# EAGLE schematic usbSimStepper-v10 (EAGLE 5.04)
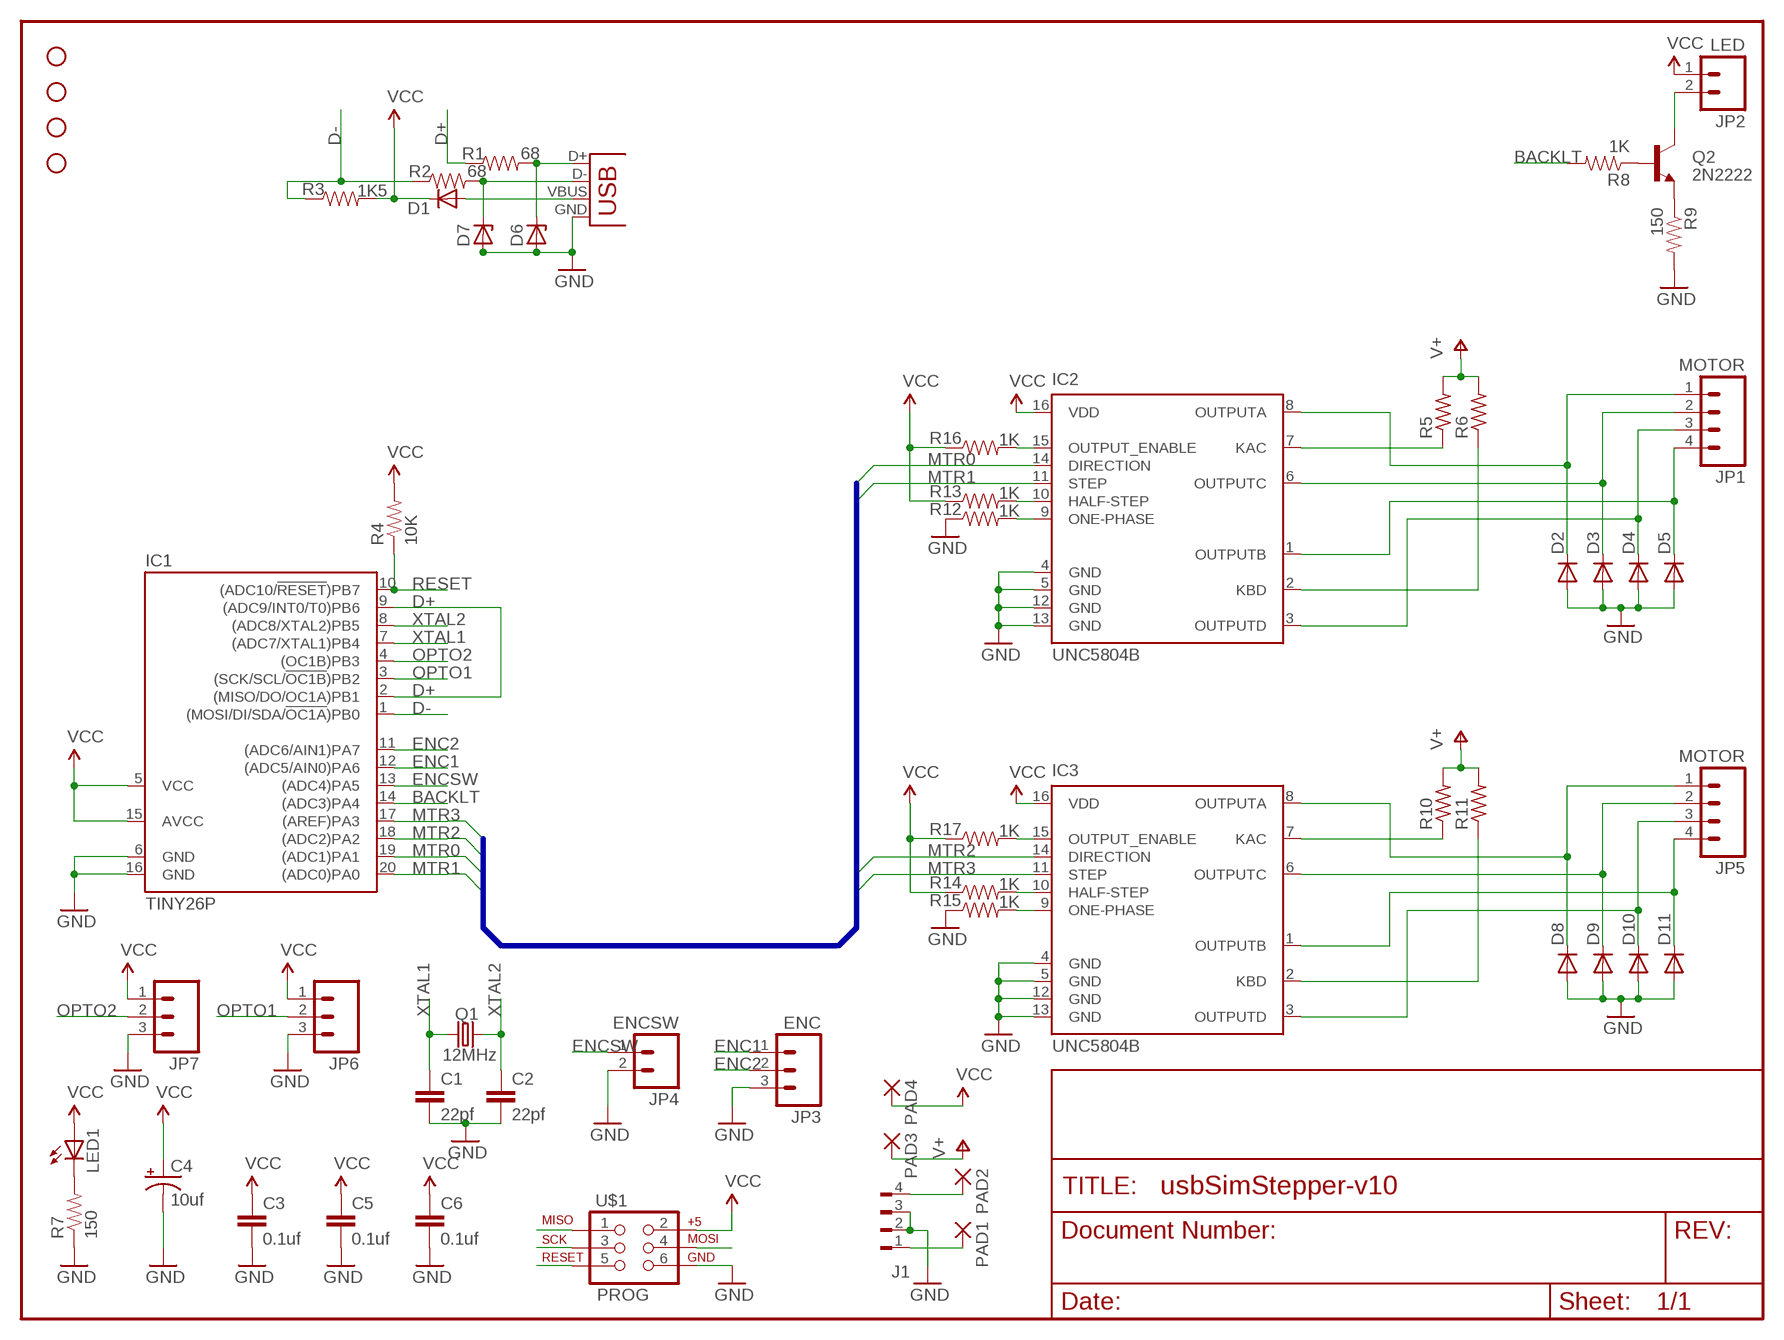
[diagram p0: schematic, sheet 1]

## Parts
C1  22pf  CAPPTH2  [CAP-PTH-SMALL2]
C2  22pf  CAPPTH2  [CAP-PTH-SMALL2]
C3  0.1uf  CAPPTH2  [CAP-PTH-SMALL2]
C4  10uf  CAP_POLPTH2  [CPOL-RADIAL-10UF-25V]
C5  0.1uf  CAPPTH2  [CAP-PTH-SMALL2]
C6  0.1uf  CAPPTH2  [CAP-PTH-SMALL2]
D1  DIODEPTH2  [DOIDE-1N4148]
D2  DIODEPTH2  [DOIDE-1N4148]
D3  DIODEPTH2  [DOIDE-1N4148]
D4  DIODEPTH2  [DOIDE-1N4148]
D5  DIODEPTH2  [DOIDE-1N4148]
D6  1N4728  [DO41Z10]
D7  1N4728  [DO41Z10]
D8  DIODEPTH2  [DOIDE-1N4148]
D9  DIODEPTH2  [DOIDE-1N4148]
D10  DIODEPTH2  [DOIDE-1N4148]
D11  DIODEPTH2  [DOIDE-1N4148]
IC1  TINY26P  [DIL20]
IC2  UNC5804B  [DIL16]
IC3  UNC5804B  [DIL16]
J1  FLOP-4W  [FLOP-4V]
JP1  MOTOR  M04POLAR  [MOLEX-1X4]
JP2  LED  M02POLAR  [MOLEX-1X2]
JP3  ENC  M03POLAR  [MOLEX-1X3]
JP4  ENCSW  M02PTH  [1X02]
JP5  MOTOR  M04POLAR  [MOLEX-1X4]
JP6  M03POLAR  [MOLEX-1X3]
JP7  M03POLAR  [MOLEX-1X3]
LED1  LED3MM  [LED3MM]
PAD1  2,54/1,1  [2,54/1,1]
PAD2  2,54/1,1  [2,54/1,1]
PAD3  2,54/1,1  [2,54/1,1]
PAD4  2,54/1,1  [2,54/1,1]
Q1  12MHz  CRYSTALHC49US  [HC49US]
Q2  2N2222  TRANSISTOR_NPNTO92  [TO-92]
R1  68  RESISTORPTH1  [AXIAL-0.3]
R2  68  RESISTORPTH1  [AXIAL-0.3]
R3  1K5  RESISTORPTH1  [AXIAL-0.3]
R4  10K  RESISTORPTH1  [AXIAL-0.3]
R5  R-US_0414/5V  [0414V]
R6  R-US_0414/5V  [0414V]
R7  150  RESISTORPTH1  [AXIAL-0.3]
R8  1K  RESISTORPTH1  [AXIAL-0.3]
R9  150  RESISTORPTH1  [AXIAL-0.3]
R10  R-US_0414/5V  [0414V]
R11  R-US_0414/5V  [0414V]
R12  1K  RESISTORPTH1  [AXIAL-0.3]
R13  1K  RESISTORPTH1  [AXIAL-0.3]
R14  1K  RESISTORPTH1  [AXIAL-0.3]
R15  1K  RESISTORPTH1  [AXIAL-0.3]
R16  1K  RESISTORPTH1  [AXIAL-0.3]
R17  1K  RESISTORPTH1  [AXIAL-0.3]
U$1  PROG  AVR_SPI_PRG_6PTH  [2X3]
U$2  STAND-OFF  [STAND-OFF]
U$3  STAND-OFF  [STAND-OFF]
U$4  STAND-OFF  [STAND-OFF]
U$5  STAND-OFF  [STAND-OFF]
X1  USBPTH  [USB-B-PTH]

## Nets
BACKLT: IC1.14((ADC3)PA4) R8.P$2
D+: IC1.2((MISO/DO/OC1A)PB1) IC1.9((ADC9/INT0/T0)PB6) R1.P$1
D-: IC1.1((MOSI/DI/SDA/!OC1A!)PB0) R2.P$1 R3.P$1
ENC1: IC1.12((ADC5/AIN0)PA6) JP3.1
ENC2: IC1.11((ADC6/AIN1)PA7) JP3.2
ENCSW: IC1.13((ADC4)PA5) JP4.1
GND: C1.2 C2.2 C3.2 C4.2(-) C5.2 C6.2 D2.A D3.A D4.A D5.A D6.A D7.A D8.A D9.A D10.A D11.A IC1.6(GND) IC1.16(GND) IC2.4(GND) IC2.5(GND) IC2.12(GND) IC2.13(GND) IC3.4(GND) IC3.5(GND) IC3.12(GND) IC3.13(GND) J1.2 J1.3 JP3.3 JP4.2 JP6.3 JP7.3 R7.P$1 R9.P$2 R12.P$1 R15.P$1 U$1.6 X1.GND
MTR0: IC1.19((ADC1)PA1) IC2.14(DIRECTION)
MTR1: IC1.20((ADC0)PA0) IC2.11(STEP)
MTR2: IC1.18((ADC2)PA2) IC3.14(DIRECTION)
MTR3: IC1.17((AREF)PA3) IC3.11(STEP)
N$1: IC2.9(ONE-PHASE) R12.P$2
N$2: IC2.10(HALF-STEP) R13.P$2
N$3: D7.C R2.P$2 X1.D-
N$4: D6.C R1.P$2 X1.D+
N$5: D1.A X1.VBUS
N$6: J1.4 PAD2.1(P)
N$7: IC3.10(HALF-STEP) R14.P$2
N$8: J1.1 PAD1.1(P)
N$9: IC2.2(KBD) R6.1
N$10: IC2.15(OUTPUT_ENABLE) R16.P$2
N$11: IC3.15(OUTPUT_ENABLE) R17.P$2
N$12: IC2.7(KAC) R5.1
N$13: LED1.K(C) R7.P$2
N$14: Q2.2(B) R8.P$1
N$15: D2.C IC2.8(OUTPUTA) JP1.1
N$16: D3.C IC2.6(OUTPUTC) JP1.2
N$17: D5.C IC2.1(OUTPUTB) JP1.4
N$18: D4.C IC2.3(OUTPUTD) JP1.3
N$19: JP2.2 Q2.3(C)
N$20: Q2.1(E) R9.P$1
N$21: IC3.9(ONE-PHASE) R15.P$2
N$25: IC3.2(KBD) R11.1
N$27: IC3.7(KAC) R10.1
N$28: D8.C IC3.8(OUTPUTA) JP5.1
N$29: D9.C IC3.6(OUTPUTC) JP5.2
N$30: D11.C IC3.1(OUTPUTB) JP5.4
N$31: D10.C IC3.3(OUTPUTD) JP5.3
OPTO1: IC1.3((SCK/SCL/!OC1B!)PB2) JP6.2
OPTO2: IC1.4((OC1B)PB3) JP7.2
PB1: U$1.1 U$1.4
PB2: U$1.3
RESET: IC1.10((ADC10/!RESET!)PB7) R4.P$1 U$1.5
V+: PAD3.1(P) R5.2 R6.2 R10.2 R11.2
VCC: C3.1 C4.1(+) C5.1 C6.1 D1.C IC1.5(VCC) IC1.15(AVCC) IC2.16(VDD) IC3.16(VDD) JP2.1 JP6.1 JP7.1 LED1.A PAD4.1(P) R3.P$2 R4.P$2 R13.P$1 R14.P$1 R16.P$1 R17.P$1 U$1.2
XTAL1: C1.1 IC1.7((ADC7/XTAL1)PB4) Q1.1
XTAL2: C2.1 IC1.8((ADC8/XTAL2)PB5) Q1.2

## Buses
MTR[0..7]

## Library data of the parts
C1-C3 C5 C6 = SparkFun:CAP: Capacitor Standard 0603 ceramic capacitor, and 0.1" leaded capacitor.
C4 = SparkFun:CAP_POL: Capacitor Polarized These are standard SMD and PTH capacitors. Normally 10uF, 47uF, and 100uF in electrolytic and tantalum varieties. Always verify the external diameter of the through hole cap, it varies with capacity, voltage, and manufacturer. The EIA devices should be standard.
D1-D5 D8-D11 = SparkFun:DIODE: Diode These are standard reverse protection diodes and small signal diodes. SMA package can handle up to about 1A. SOD-323 can handle about 200mA. What the SOD-323 package when ordering, there are some mfgs out there that are 5-pin packages.
D6 D7 = diode:1N4728: Z DIODE 3.3 V, 1W, 5 percent
IC1 = atmel:TINY26*: 8-bit AVR Microcontroller with 2K Bytes Flash Source: http://www.atmel.com .. doc1477.pdf
IC2 IC3 = allegro:UNC5804: BiMOS II UNIPOLAR STEPPER-MOTOR TRANSLATOR/DRIVER Source: 5804.pdf
J1 = con-amp:FLOP-4W: MATE N-LOCK Floppy / HDD conector Distributor: Bürklin 71F972
JP1 JP5 = SparkFun:M04: Header 4 Standard 4-pin 0.1" header. Use with straight break away headers (SKU : PRT-00116), right angle break away headers (PRT-00553), swiss pins (PRT-00743), machine pins (PRT-00117), and female headers (PRT-00115). Molex polarized connector foot print use with SKU : PRT-08231 with associated crimp pins and housings.
JP2 JP4 = SparkFun:M02: Header 2 Standard 2-pin 0.1" header. Use with straight break away headers (SKU : PRT-00116), right angle break away headers (PRT-00553), swiss pins (PRT-00743), machine pins (PRT-00117), and female headers (PRT-00115). Molex polarized connector foot print use with SKU : PRT-08233 with associated crimp pins and housings.
JP3 JP6 JP7 = SparkFun:M03: Header 3 Standard 3-pin 0.1" header. Use with straight break away headers (SKU : PRT-00116), right angle break away headers (PRT-00553), swiss pins (PRT-00743), machine pins (PRT-00117), and female headers (PRT-00115). Molex polarized connector foot print use with SKU : PRT-08232 with associated crimp pins and housings.
LED1 = SparkFun:LED: LEDs Standard schematic elements and footprints for 5mm, 3mm, 1206, and 0603 sized LEDs. 5mm - Spark Fun Electronics SKU : COM-00529 (and others)
PAD1-PAD4 = wirepad:2,54/1,1: THROUGH-HOLE PAD
Q1 = SparkFun:CRYSTAL: Crystals Various standard crystals. Proven footprints. Spark Fun Electronics SKU : COM-00534
Q2 = SparkFun:TRANSISTOR_NPN: Transistor NPN BJT configuration in SOT23 package. MMBT2222 is the common NPN we use. Double check BCE configuration again layout.
R1-R4 R7-R9 R12-R17 = SparkFun:RESISTOR: Resistor Basic schematic elements and footprints for 0603, 1206, and PTH 1/10th watt (small) resistors.
R5 R6 R10 R11 = resistor:R-US_: RESISTOR, American symbol
U$1 = SparkFun:AVR_SPI_PRG_6: AVR ISP 6 Pin This is the reduced ISP connector for AVR programming. Common on Arduino. This footprint will take up less PCB space and can be used with a 10-pin to 6-pin adapter such as SKU: BOB-08508
U$2-U$5 = SparkFun:STAND-OFF: Stand Off This is the mechanical footprint for a #4 phillips button head screw. Use the keepout ring to avoid running the screw head into surrounding components. SKU : PRT-00447
X1 = SparkFun:USB: USB Connectors USB-B-PTH is fully proven SKU : PRT-00139 USB-miniB is fully proven SKU : PRT-00587 USB-A-PCB is untested. USB-A-H is throughly reviewed, but untested. Spark Fun Electronics SKU : PRT-00437 USB-B-SMT is throughly reviewed, but untested. Needs silkscreen touching up. USB-A-S has not been used/tested USB-MB-H has not been used/tested